# Altium project ERN_Main.PrjPcb
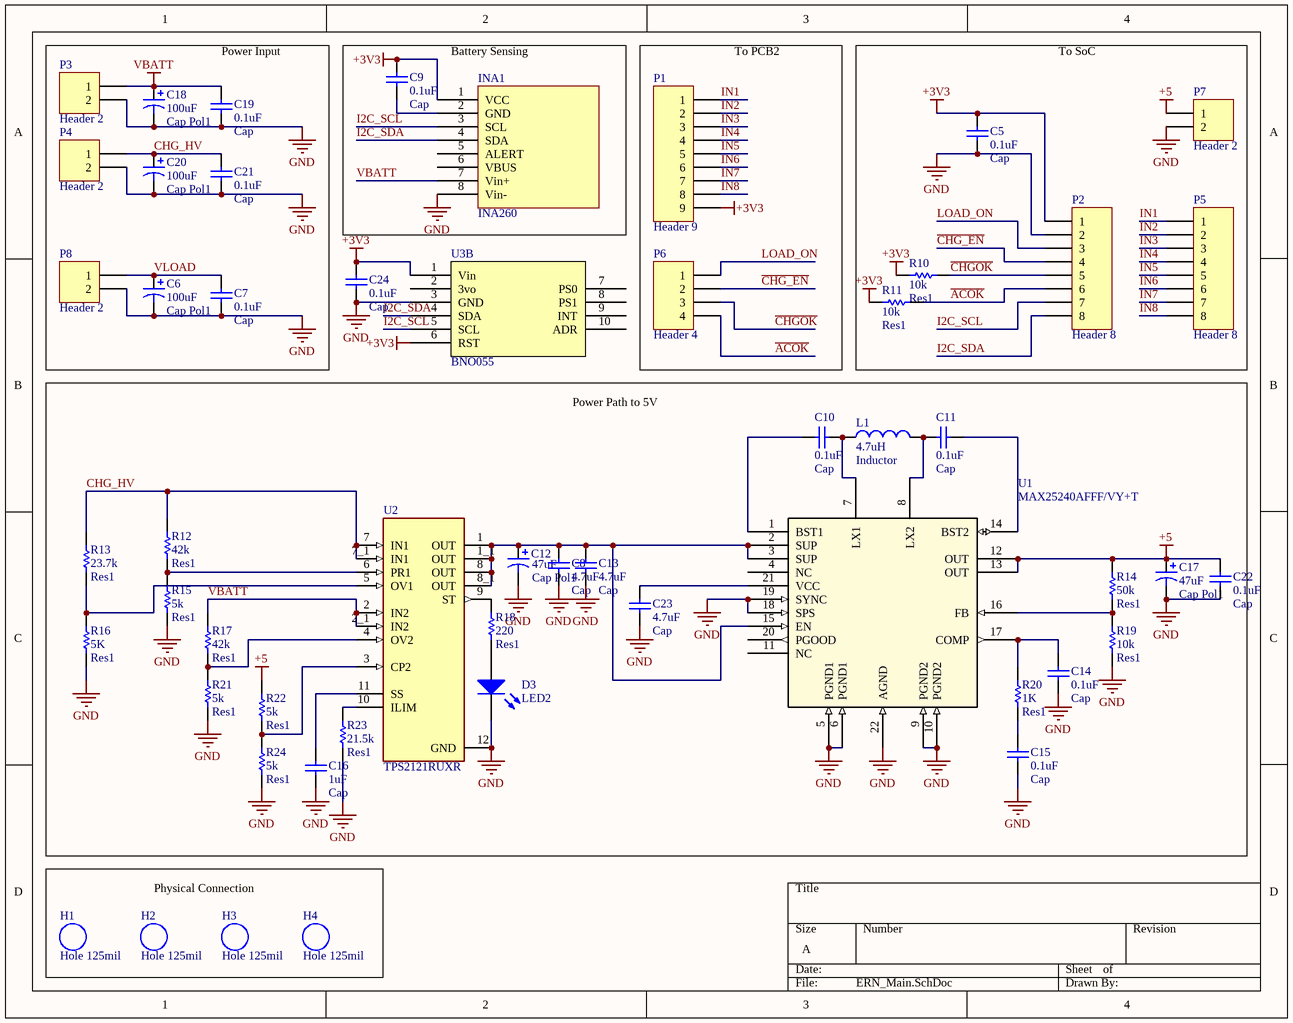
[diagram p0: ERN_Main.SchDoc]
2 sheets, 73 parts. Net scope: global (net labels, ports and power ports of the same name join across sheets).
Board file: ERN_MainPCB.PcbDoc
Sheets:
  ERN_Main.SchDoc
  ERN_Main_2.SchDoc

## Sheet ERN_Main.SchDoc
size A; SheetNumber: 1; SheetTotal: 2; SPICEModelCacheDBTNACQE: <root> / <DocumentId>DBTNACQE</DocumentId> / <CacheFrame Number="0"> / <Model Name="led2" Kind="MDL"> / <Text>*Typ RED,GREEN,YELLOW,AMBER GaAs LED: Vf=2.1V Vr=4V If=40mA trr=3uS / *LED Pinout: 1=A, 2=K / .MODEL LED2 D (IS=93.1P RS=42M N=4.61 BV=4 IBV=10U / + CJO=2.97P VJ=.75 M=.333 TT=4.32U)</Text> / </Model> / </CacheFrame> / </root>

### Parts
C5  Cap  value 0.1uF  [RAD-0.3]
C6  Cap Pol1  value 100uF  [Cap_47uF_100uF]
C7  Cap  value 0.1uF  [RAD-0.3]
C8  Cap  value 4.7uF  [c0805]
C9  Cap  value 0.1uF  [RAD-0.3]
C10  Cap  value 0.1uF  [c0805]
C11  Cap  value 0.1uF  [c0805]
C12  Cap Pol1  value 47uF  [Cap_47uF_100uF]
C13  Cap  value 4.7uF  [c0805]
C14  Cap  value 0.1uF  [RAD-0.3]
C15  Cap  value 0.1uF  [RAD-0.3]
C16  Cap  value 1uF  [C0805]
C17  Cap Pol1  value 47uF  [Cap_47uF_100uF]
C18  Cap Pol1  value 100uF  [Cap_47uF_100uF]
C19  Cap  value 0.1uF  [RAD-0.3]
C20  Cap Pol1  value 100uF  [Cap_47uF_100uF]
C21  Cap  value 0.1uF  [RAD-0.3]
C22  Cap  value 0.1uF  [RAD-0.3]
C23  Cap  value 4.7uF  [c0805]
C24  Cap  value 0.1uF  [RAD-0.3]
D3  LED2  [led-0]
H1  Hole 125mil  [Hole 125mil]
H2  Hole 125mil  [Hole 125mil]
H3  Hole 125mil  [Hole 125mil]
H4  Hole 125mil  [Hole 125mil]
INA1  INA260  [INA260_Breakout]
L1  Inductor  value 4.7uH  [SRP6540-4R7M]
P1  Header 9  [HDR1X9]
P2  Header 8  [HDR1X8]
P3  Header 2  [HDR1X2]
P4  Header 2  [HDR1X2]
P5  Header 8  [HDR1X8]
P6  Header 4  [HDR1X4]
P7  Header 2  [HDR1X2]
P8  Header 2  [HDR1X2]
R10  Res1  value 10k  [AXIAL-0.3]
R11  Res1  value 10k  [AXIAL-0.3]
R12  Res1  value 42k  [AXIAL-0.3]
R13  Res1  value 23.7k  [AXIAL-0.3]
R14  Res1  value 50k  [AXIAL-0.3]
R15  Res1  value 5k  [AXIAL-0.3]
R16  Res1  value 5K  [AXIAL-0.3]
R17  Res1  value 42k  [AXIAL-0.3]
R18  Res1  value 220  [AXIAL-0.3]
R19  Res1  value 10k  [AXIAL-0.3]
R20  Res1  value 1K  [AXIAL-0.3]
R21  Res1  value 5k  [AXIAL-0.3]
R22  Res1  value 5k  [AXIAL-0.3]
R23  Res1  value 21.5k  [AXIAL-0.3]
R24  Res1  value 5k  [AXIAL-0.3]
U1  MAX25240AFFF/VY+T  [21-100399_90-100137_ADI - duplicate]
U2  TPS2121RUXR  [IC_TPS2121RUXR]
U3  BNO055  [BNO055_Breakout]  (part B of 2)

### Blocks framed on the sheet
Power Input: C6 C7 C18-C21 P3 P4 P8
Battery Sensing: C9 INA1
To PCB2: P1 P6
To SoC: C5 P2 P5 P7 R10 R11
Power Path to 5V: C8 C10-C17 C22 C23 D3 L1 R12-R24 U1 U2
Physical Connection: H1-H4

### Nets
+3V3: C5.2 C9.1 C24.1 INA1.1(VCC) P1.9 P2.1 R10.1 R11.1 U3.1(Vin) U3.6(RST)
+5: C17.1 C22.2 P7.1 R14.1 R22.1 U1.12(OUT) U1.13(OUT)
GND: C5.1 C6.2 C7.1 C8.1 C12.2 C13.1 C14.1 C15.1 C16.2 C17.2 C18.2 C19.1 C20.2 C21.1 C22.1 C23.1 C24.2 D3.2(K) INA1.8(Vin-) P2.2 P3.2 P4.2 P7.2 P8.2 R15.2 R16.2 R19.2 R21.2 R23.2 R24.2 U1.5(PGND1) U1.6(PGND1) U1.9(PGND2) U1.10(PGND2) U1.18(SPS) U1.19(SYNC) U1.22(AGND) U2.12(GND) U3.3(GND)
VBATT: C18.1 C19.2 INA1.7(Vin+) P3.1 R17.1 U2.2(IN2) U2.2_1(IN2)
VLOAD: C6.1 C7.2 P8.1
~{ACOK}: P2.6 P6.4 R11.2
~{CHG_EN}: P2.4 P6.2
~{CHGOK}: P2.5 P6.3 R10.2
CHG_HV: C20.1 C21.2 P4.1 R12.1 R13.1 U2.7(IN1) U2.7_1(IN1)
I2C_SCL: INA1.3(SCL) P2.7 U3.5(SCL)
I2C_SDA: INA1.4(SDA) P2.8 U3.4(SDA)
IN1: P1.1 P5.1
IN2: P1.2 P5.2
IN3: P1.3 P5.3
IN4: P1.4 P5.4
IN5: P1.5 P5.5
IN6: P1.6 P5.6
IN7: P1.7 P5.7
IN8: P1.8 P5.8
LOAD_ON: P2.3 P6.1
NetC8_2: C8.2 C12.1 C13.2 U1.2(SUP) U1.3(SUP) U1.15(EN) U2.1(OUT) U2.1_1(OUT) U2.8(OUT) U2.8_1(OUT)
NetC9_2: C9.2 INA1.2(GND)
NetC10_1: C10.1 U1.1(BST1)
NetC10_2: C10.2 L1.1 U1.7(LX1)
NetC11_1: C11.1 L1.2 U1.8(LX2)
NetC11_2: C11.2 U1.14(BST2)
NetC14_2: C14.2 R20.1 U1.17(COMP)
NetC15_2: C15.2 R20.2
NetC16_1: C16.1 U2.11(SS)
NetC23_2: C23.2 U1.21(VCC)
NetD3_1: D3.1(A) R18.2
NetR12_2: R12.2 R15.1 U2.6(PR1)
NetR13_2: R13.2 R16.1 U2.5(OV1)
NetR14_2: R14.2 R19.1 U1.16(FB)
NetR17_2: R17.2 R21.1 U2.4(OV2)
NetR18_1: R18.1 U2.9(ST)
NetR22_2: R22.2 R24.1 U2.3(CP2)
NetR23_1: R23.1 U2.10(ILIM)

Not connected (* = marked no-connect by the designer): INA1 5(ALERT) 6(VBUS); U1 4(NC) 11(NC) 20(PGOOD); U3 2(3vo) 7(PS0) 8(PS1) 9(INT) 10(ADR)

### Library data of the parts
C5 C7-C11 C13-C16 C19 C21-C24 = Cap: Capacitor; Published: 8-Jun-2000; LatestRevisionDate: 17-Jul-2002; LatestRevisionNote: Re-released for DXP Platform.; PackageReference: RAD-0.3; Publisher: Altium Limited; PackageDescription: Radial Cap, Thru-Hole; 2 Leads; 0.3 in Pin Spacing
C6 C12 C17 C18 C20 = Cap Pol1: Polarized Capacitor (Radial); Published: 8-Jun-2000; LatestRevisionDate: 17-Jul-2002; LatestRevisionNote: Re-released for DXP Platform.; PackageReference: RB7.6-15; Publisher: Altium Limited; PackageDescription: Polarized Capacitor (Radial); 2 Leads
D3 = LED2: Typical RED, GREEN, YELLOW, AMBER GaAs LED; Published: 8-Jun-2000; LatestRevisionDate: 17-Jul-2002; LatestRevisionNote: Re-released for DXP Platform.; PackageVersion: Feb-2002; PackageReference: 3.2X1.6X1.1; Publisher: Altium Limited; PackageDescription: SM LED; 2 Flat Leads
INA1 = INA260_Breakout: Voltage and current sensor
L1 = Inductor: Code_IEC: 1005; Published: 8-Jun-2000; LatestRevisionDate: 29-May-2009; LatestRevisionNote: IPC-7351 Footprint Added.; PackageReference: 0402-A; Publisher: Altium Limited; PackageDescription: Chip Inductor; Code_JEITA: 0402
P1 = Header 9: Header, 9-Pin; LatestRevisionDate: 17-Jul-2002; LatestRevisionNote: Re-released for DXP Platform.; Publisher: Altium Limited
P2 P5 = Header 8: Header, 8-Pin; LatestRevisionDate: 17-Jul-2002; LatestRevisionNote: Re-released for DXP Platform.; Publisher: Altium Limited
P3 P4 P7 P8 = Header 2: Header, 2-Pin; LatestRevisionDate: 17-Jul-2002; LatestRevisionNote: Re-released for DXP Platform.; Publisher: Altium Limited
P6 = Header 4: Header, 4-Pin; LatestRevisionDate: 17-Jul-2002; LatestRevisionNote: Re-released for DXP Platform.; Publisher: Altium Limited
R10-R24 = Res1: Resistor; Published: 8-Jun-2000; LatestRevisionDate: 17-Jul-2002; LatestRevisionNote: Re-released for DXP Platform.; PackageReference: AXIAL-0.3; Publisher: Altium Limited; PackageDescription: Axial Device, Thru-Hole; 2 Leads; 0.3 in Pin Spacing
U1 = MAX25240AFFFVY+T: Automotive 2V to 36V, 6A Buck-Boost Converters; Manufacturer_Name: Analog Devices Inc; Type: RF; Copyright: Copyright (C) 2025 Ultra Librarian. All rights reserved.; Manufacturer_Part_Number: MAX25240AFFF/VY+T; RefDes: RefDes
U2 = TPS2121RUXR: 2.7-V&nbsp;to 22-V, 56-mâ„¦, 4.5-A, power mux with seamless switchover; MF: Texas Instruments; Package: VQFN-HR-12 Texas Instruments; Price: None; Check_prices: https://www.snapeda.com/parts/TPS2121RUXR/Texas+Instruments/view-part/?ref=eda; Value: *; SnapEDA_Link: https://www.snapeda.com/parts/TPS2121RUXR/Texas+Instruments/view-part/?ref=snap; MP: TPS2121RUXR; Availability: In Stock; Purchase-URL: https://pricing.snapeda.com/search?q=TPS2121RUXR&ref=eda
U3 = BNO055_Breakout: Adafruit IMU Breakout

## Sheet ERN_Main_2.SchDoc
size A; SheetNumber: 2; SheetTotal: 2; SPICEModelCacheYVUKJMZF: <root> / <DocumentId>YVUKJMZF</DocumentId> / <CacheFrame Number="0"> / <Model Name="1n4148" Kind="MDL"> / <Text>.model 1N4148  D(Is=0.1p Rs=16 CJO=2p Tt=12n Bv=100 Ibv=0.1p)</Text> / </Model> / <Model Name="npn" Kind="MDL"> / <Text>*Default NPN BJT / *NPN Trans Pinout: C,B,E / .MODEL NPN NPN()</Text> / </Model> / <Model Name="pnp" Kind="MDL"> / <Text>*Default PNP BJT / *PNP Trans Pinout: C,B,E / .MODEL PNP PNP()</Text> / </Model> / </CacheFrame> / </root>
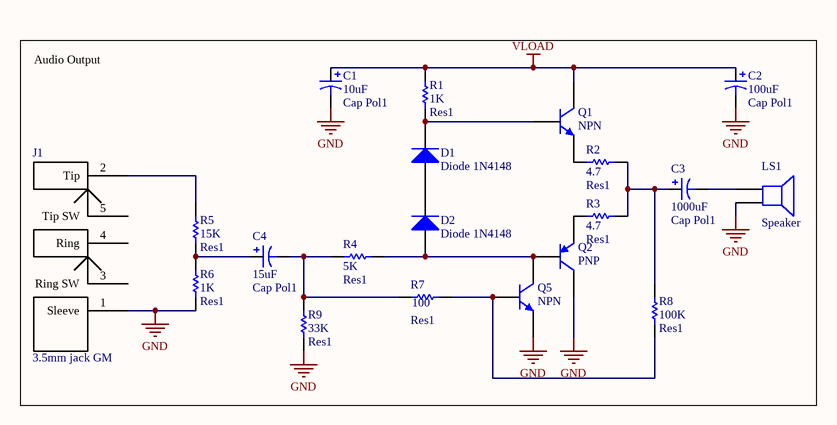
[diagram p1: ERN_Main_2.SchDoc]

### Parts
C1  Cap Pol1  value 10uF  [Cap_10uF]
C2  Cap Pol1  value 100uF  [Cap_47uF_100uF]
C3  Cap Pol1  value 1000uF  [Cap_1000uF]
C4  Cap Pol1  value 15uF  [Cap_10uF]
D1  Diode 1N4148  [DO-35]
D2  Diode 1N4148  [DO-35]
J1  3.5mm jack GM  [3.5mm jack GM]
LS1  Speaker  [PIN2]
Q1  NPN  [TO92254P460H750-3]
Q2  PNP  [TO92254P460H750-3]
Q5  NPN  [TO92254P460H750-3]
R1  Res1  value 1K  [AXIAL-0.3]
R2  Res1  value 4.7  [AXIAL-0.3]
R3  Res1  value 4.7  [AXIAL-0.3]
R4  Res1  value 5K  [AXIAL-0.3]
R5  Res1  value 15K  [AXIAL-0.3]
R6  Res1  value 1K  [AXIAL-0.3]
R7  Res1  value 100  [AXIAL-0.3]
R8  Res1  value 100K  [AXIAL-0.3]
R9  Res1  value 33K  [AXIAL-0.3]

### Blocks framed on the sheet
Audio Output: C1-C4 D1 D2 J1 LS1 Q1 Q2 Q5 R1-R9

### Nets
GND: C1.2 C2.2 J1.1(Sleeve) LS1.2 Q2.1(C) Q5.3(E) R6.1 R9.1
VLOAD: C1.1 C2.1 Q1.1(C) R1.2
NetC3_1: C3.1 R2.2 R3.2 R8.2
NetC3_2: C3.2 LS1.1
NetC4_1: C4.1 R5.1 R6.2
NetC4_2: C4.2 R4.1 R7.1 R9.2
NetD1_1: D1.1(A) D2.2(K)
NetD1_2: D1.2(K) Q1.2(B) R1.1
NetD2_1: D2.1(A) Q2.2(B) Q5.1(C) R4.2
NetJ1_2: J1.2(Tip) R5.2
NetQ1_3: Q1.3(E) R2.1
NetQ2_3: Q2.3(E) R3.1
NetQ5_2: Q5.2(B) R7.2 R8.1

Not connected (* = marked no-connect by the designer): J1 3(Ring_SW) 4(Ring) 5(Tip_SW)

### Library data of the parts
C1-C4 = Cap Pol1: Polarized Capacitor (Radial); Published: 8-Jun-2000; LatestRevisionDate: 17-Jul-2002; LatestRevisionNote: Re-released for DXP Platform.; PackageReference: RB7.6-15; Publisher: Altium Limited; PackageDescription: Polarized Capacitor (Radial); 2 Leads
D1 D2 = Diode 1N4148: High Conductance Fast Diode; Published: 8-Jun-2000; LatestRevisionDate: 17-Jul-2002; LatestRevisionNote: Re-released for DXP Platform.; DatasheetVersion: 1997; PackageReference: DO-35; Publisher: Altium Limited; PackageDescription: Diode, Axial; Body 3.8 x 1.9 mm (LxDia. max), Lead Dia. 0.53 mm (max); Code_JEDEC: DO-204-AH; ComponentLink1Description: Manufacturer Link; ComponentLink1URL: http://www.fairchildsemi.com/; ComponentLink2Description: Datasheet; ComponentLink2URL: http://www.fairchildsemi.com/ds/1N%2F1N4148.pdf
LS1 = Speaker: Loudspeaker; Published: 24-Mar-1999; LatestRevisionDate: 17-Jul-2002; LatestRevisionNote: Re-released for DXP Platform.; PackageReference: PIN2; Publisher: Altium Limited
Q1 Q5 = NPN: NPN Bipolar Transistor; Published: 8-Jun-2000; LatestRevisionDate: 17-Jul-2002; LatestRevisionNote: Re-released for DXP Platform.; PackageReference: TO-226-AA; Publisher: Altium Limited; PackageDescription: TO, Flat Index; 3 In-Line, Axial Leads; Body Dia. 4.8mm; Leads 0.55 x 0.51 mm (max); Code_JEDEC: TO-226-AA
Q2 = PNP: PNP Bipolar Transistor; Published: 8-Jun-2000; LatestRevisionDate: 29-May-2009; LatestRevisionNote: IPC-7351 Footprint Added.; PackageVersion: Aug-1999; PackageReference: SOT-23B; Publisher: Altium Limited; PackageDescription: 3-Pin SOT-23 Package 0.95 mm Pitch, 2.4 mm Lead Span
R1-R9 = Res1: Resistor; Published: 8-Jun-2000; LatestRevisionDate: 17-Jul-2002; LatestRevisionNote: Re-released for DXP Platform.; PackageReference: AXIAL-0.3; Publisher: Altium Limited; PackageDescription: Axial Device, Thru-Hole; 2 Leads; 0.3 in Pin Spacing

## Nets that join several sheets
GND: ERN_Main (39 pins), ERN_Main_2 (8 pins)
VLOAD: ERN_Main (C6.1 C7.2 P8.1), ERN_Main_2 (C1.1 C2.1 Q1.1 R1.2)